# EAGLE schematic cwm_ (EAGLE 7.5.0)
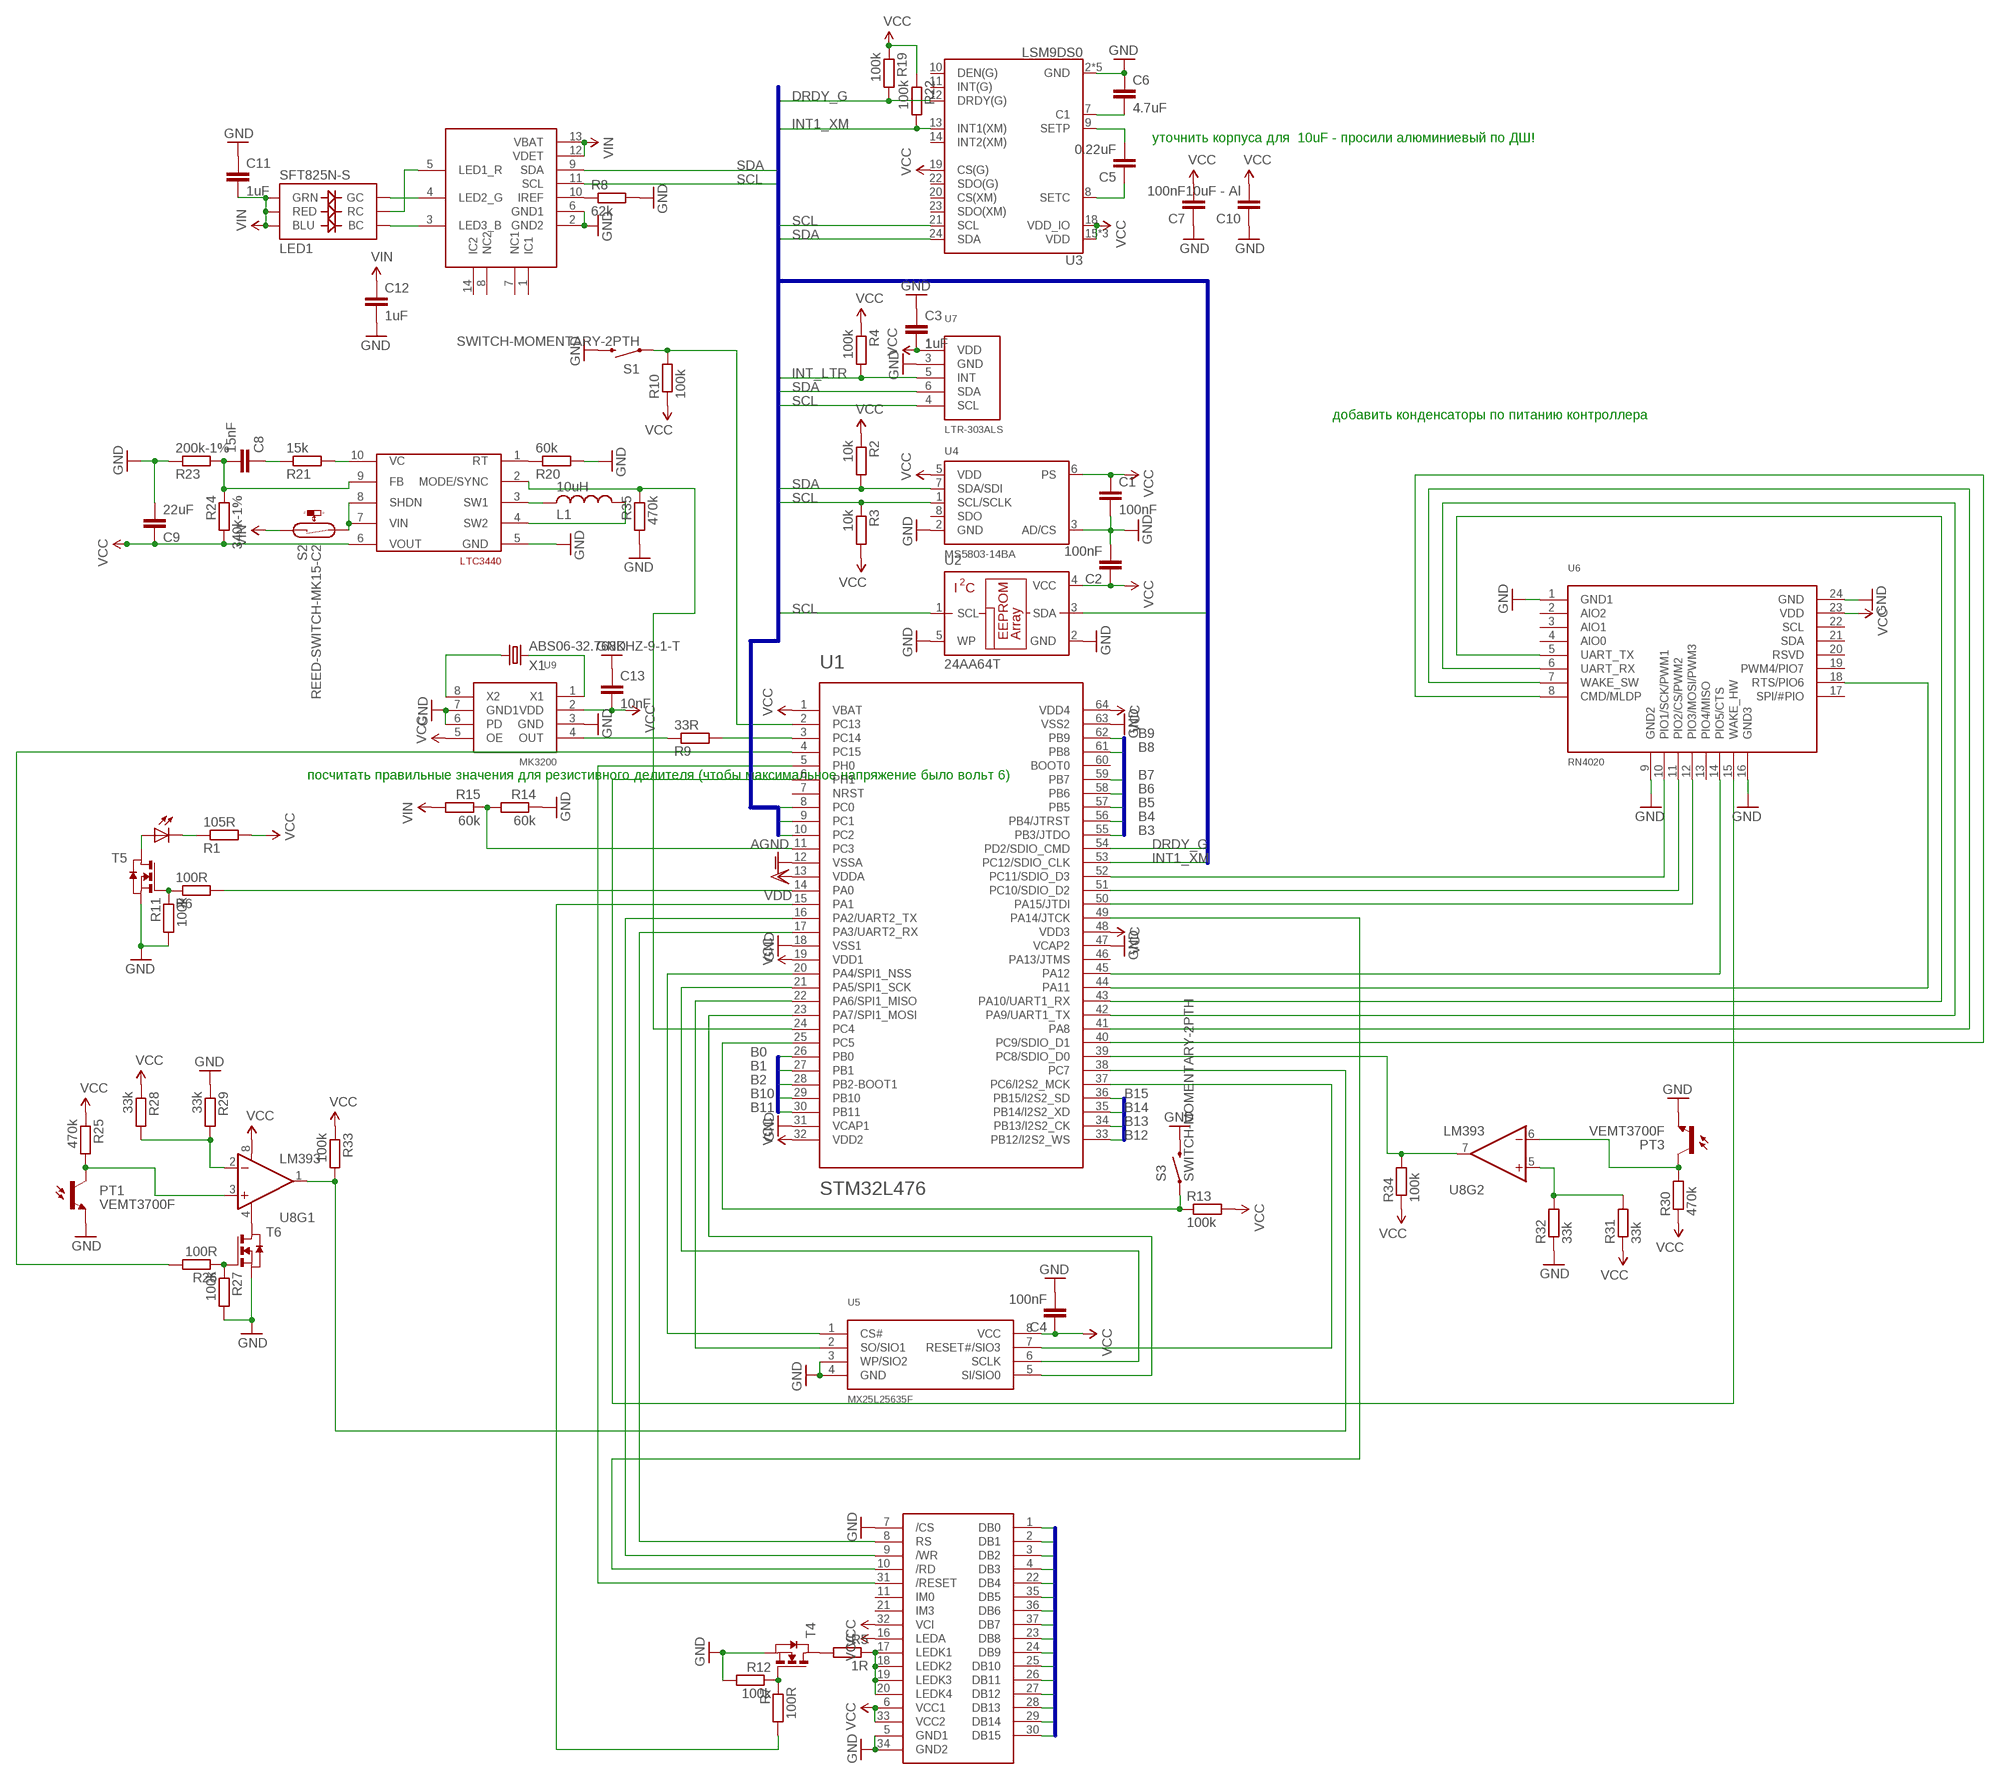
[diagram p0: schematic, sheet 1]

## Parts
C1  100nF  C-EUC0402  [C0402]
C2  100nF  C-EUC0402  [C0402]
C3  1uF  C-EUC0603  [C0603]
C4  100nF  C-EUC0402  [C0402]
C5  0.22uF  C-EUC0402  [C0402]
C6  4.7uF  C-EUC0805  [C0805]
C7  100nF  C-EUC0402  [C0402]
C8  15nF  C-EUC0402  [C0402]
C9  22uF  C-EUC0805  [C0805]
C10  10uF - Al  C-EUC0805  [C0805]
C11  1uF  C-EUC0603  [C0603]
C12  1uF  C-EUC0603  [C0603]
C13  10nF  C-EUC0603  [C0603]
L1  10uH  L-USL3225M  [L3225M]
LED1  SFT825N-S  LED-TRICOLOR-NO-COMPLCC-6-SMD  [PLCC-6-LED]
PT1  VEMT3700F  [PLCC-2]
PT3  VEMT3700F  [PLCC-2]
R1  105R  R-EU_R0402  [R0402]
R2  10k  R-EU_R0402  [R0402]
R3  10k  R-EU_R0402  [R0402]
R4  100k  R-EU_R0402  [R0402]
R5  1R  R-EU_R0402  [R0402]
R6  100R  R-EU_R0402  [R0402]
R7  100R  R-EU_R0402  [R0402]
R8  62k  R-EU_R0402  [R0402]
R9  33R  R-EU_R0402  [R0402]
R10  100k  R-EU_R0402  [R0402]
R11  100k  R-EU_R0402  [R0402]
R12  100k  R-EU_R0402  [R0402]
R13  100k  R-EU_R0402  [R0402]
R14  60k  R-EU_R0402  [R0402]
R15  60k  R-EU_R0402  [R0402]
R19  100k  R-EU_R0402  [R0402]
R20  60k  R-EU_R0402  [R0402]
R21  15k  R-EU_R0402  [R0402]
R22  100k  R-EU_R0402  [R0402]
R23  200k-1%  R-EU_R0402  [R0402]
R24  340k-1%  R-EU_R0402  [R0402]
R25  470k  R-EU_R0402  [R0402]
R26  100R  R-EU_R0402  [R0402]
R27  100k  R-EU_R0402  [R0402]
R28  33k  R-EU_R0402  [R0402]
R29  33k  R-EU_R0402  [R0402]
R30  470k  R-EU_R0402  [R0402]
R31  33k  R-EU_R0402  [R0402]
R32  33k  R-EU_R0402  [R0402]
R33  100k  R-EU_R0402  [R0402]
R34  100k  R-EU_R0402  [R0402]
R35  470k  R-EU_R0402  [R0402]
S1  SWITCH-MOMENTARY-2PTH  [TACTILE-PTH]
S2  REED-SWITCH-MK15-C2  [MK15]
S3  SWITCH-MOMENTARY-2PTH  [TACTILE-PTH]
T4  NMOSSOT23  [SOT-23]
T5  NMOSSOT23  [SOT-23]
T6  NMOSSOT23  [SOT-23]
U1  STM32L476  STM32F405RG  [TQFP64]
U2  24AA64T  24AA00OT  [SOT23-5L]
U3  LSM9DS0  [LGA-24]
U4  MS5803-14BA  [MS5803]
U5  MX25L25635F  [WSON8L]
U6  RN4020  [RN4020]
U7  LTR-303ALS  [LTR-303ALS]
U8  LM393  [SO08]
U9  MK3200  [SOIC8]
U$1  S95466-AAA  [S95466-AAA]
U$2  VSML3710  [PLCC-2]
U$3  NCP5623  [NCP5623]
U$9  LTC3440  [MSOP10]
X1  ABS06-32.768KHZ-9-1-T  CRYSTALS-NOGND-IQXC-25  [2.0X1.2-2PAD]

## Nets
AGND: U1.12(VSSA)
B0: U1.26(PB0) U$1.1(DB0)
B1: U1.27(PB1) U$1.2(DB1)
B2: U1.28(PB2-BOOT1) U$1.3(DB2)
B3: U1.55(PB3/JTDO) U$1.4(DB3)
B4: U1.56(PB4/JTRST) U$1.22(DB4)
B5: U1.57(PB5) U$1.35(DB5)
B6: U1.58(PB6) U$1.36(DB6)
B7: U1.59(PB7) U$1.37(DB7)
B8: U1.61(PB8) U$1.23(DB8)
B9: U1.62(PB9) U$1.24(DB9)
B10: U1.29(PB10) U$1.25(DB10)
B11: U1.30(PB11) U$1.26(DB11)
B12: U1.33(PB12/I2S2_WS) U$1.27(DB12)
B13: U1.34(PB13/I2S2_CK) U$1.28(DB13)
B14: U1.35(PB14/I2S2_XD) U$1.29(DB14)
B15: U1.36(PB15/I2S2_SD) U$1.30(DB15)
DRDY_G: R19.2 U1.54(PD2/SDIO_CMD) U3.12(DRDY(G))
GND [GND]: C1.2 C2.2 C3.1 C4.2 C6.1 C7.1 C9.2 C10.1 C11.1 C12.2 C13.1 PT1.P$2(E) PT3.P$2(E) R8.2 R11.2 R12.2 R14.1 R20.2 R23.1 R27.2 R29.1 R32.1 R35.2 S1.3 S3.3 T4.2(S) T5.2(S) T6.2(S) U1.18(VSS1) U1.31(VCAP1) U1.47(VCAP2) U1.63(VSS2) U2.2(GND) U2.5(WP) U3.2(GND) U3.3(GND) U3.4(GND) U3.5(GND) U3.6(GND) U4.2(GND) U4.3(AD/CS) U5.3(WP/SIO2) U5.4(GND) U6.1(GND1) U6.9(GND2) U6.16(GND3) U6.24(GND) U7.3(GND) U9.3(GND) U9.6(PD) U9.7(GND1) U$1.5(GND1) U$1.7(/CS) U$1.34(GND2) U$3.2(GND2) U$3.6(GND1) U$9.5(GND)
INT1_XM: R22.2 U1.53(PC12/SDIO_CLK) U3.13(INT1(XM))
INT_LTR: R4.2 U1.10(PC2) U7.5(INT)
N$1 [VIN]: S2.2 U$9.7(VIN) U$9.8(SHDN)
N$2: R5.1 U$1.17(LEDK1) U$1.18(LEDK2) U$1.19(LEDK3) U$1.20(LEDK4)
N$3: T5.1(D) U$2.P$2(A)
N$4: C5.2 U3.9(SETP)
N$5: U1.6(PH1) U6.15(WAKE_HW)
N$6: U1.17(PA3/UART2_RX) U$1.8(RS)
N$7: U1.5(PH0) U$1.31(/RESET)
N$8: U1.16(PA2/UART2_TX) U$1.9(/WR)
N$9: R35.1 U1.24(PC4) U$9.2(MODE/SYNC)
N$10: R5.2 T4.1(D)
N$11: LED1.CG(GC) U$3.4(LED2_G)
N$12: LED1.CB(BC) U$3.3(LED3_B)
N$13: LED1.CR(RC) U$3.5(LED1_R)
N$14: R1.1 U$2.P$1(C)
N$15: R6.1 R11.1 T5.3(G)
N$16: R6.2 U1.14(PA0)
N$17: R7.1 R12.1 T4.3(G)
N$18: R7.2 U1.15(PA1)
N$19: U9.1(X1) X1.2
N$20: R8.1 U$3.10(IREF)
N$21: U9.8(X2) X1.1
N$22: R9.1 U9.4(OUT)
N$23: U1.49(PA14/JTCK) U$1.10(/RD)
N$24: R10.2 S1.1 U1.2(PC13)
N$25: R13.1 S3.1 U1.25(PC5)
N$26: R9.2 U1.3(PC14)
N$27: U1.42(PA9/UART1_TX) U6.6(UART_RX)
N$28: L1.2 U$9.3(SW1)
N$29: L1.1 U$9.4(SW2)
N$30: C5.1 U3.8(SETC)
N$31: C6.2 U3.7(C1)
N$32: T6.1(D) U8.4(V-)
N$33: PT1.P$1(C) R25.2 U8.3(+IN)
N$34: R28.2 R29.2 U8.2(-IN)
N$37: PT3.P$1(C) R30.2 U8.6(-IN)
N$38: R26.1 R27.1 T6.3(G)
N$39: R26.2 U1.4(PC15)
N$40: R31.2 R32.2 U8.5(+IN)
N$41: R33.2 U1.38(PC7) U8.1(OUT)
N$42: R34.2 U1.39(PC8/SDIO_D0) U8.7(OUT)
N$43: U1.43(PA10/UART1_RX) U6.5(UART_TX)
N$44: U1.44(PA11) U6.18(RTS/PIO6)
N$45: U1.45(PA12) U6.14(PIO5/CTS)
N$46: U1.40(PC9/SDIO_D1) U6.8(CMD/MLDP)
N$47: U1.41(PA8) U6.7(WAKE_SW)
N$49: U1.52(PC11/SDIO_D3) U6.10(PIO1/SCK/PWM1)
N$50: U1.51(PC10/SDIO_D2) U6.11(PIO2/CS/PWM2)
N$51: U1.50(PA15/JTDI) U6.12(PIO3/MOSI/PWM3)
N$52: R20.1 U$9.1(RT)
N$53: U1.20(PA4/SPI1_NSS) U5.1(CS#)
N$54: U1.22(PA6/SPI1_MISO) U5.2(SO/SIO1)
N$55: U1.37(PC6/I2S2_MCK) U5.7(RESET#/SIO3)
N$56: U1.21(PA5/SPI1_SCK) U5.6(SCLK)
N$57: U1.23(PA7/SPI1_MOSI) U5.5(SI/SIO0)
N$60: R14.2 R15.1 U1.11(PC3)
N$70: C8.2 R23.2 R24.1 U$9.9(FB)
N$73: R21.2 U$9.10(VC)
N$74: C8.1 R21.1
SCL: R3.1 U1.8(PC0) U2.1(SCL) U3.21(SCL) U4.1(SCL/SCLK) U7.4(SCL) U$3.11(SCL)
SDA: R2.2 U1.9(PC1) U2.3(SDA) U3.24(SDA) U4.7(SDA/SDI) U7.6(SDA) U$3.9(SDA)
VCC [VCC]: C1.1 C2.1 C3.2 C4.1 C7.2 C9.1 C10.2 C13.2 R1.2 R2.1 R3.2 R4.1 R10.1 R13.2 R19.1 R22.1 R24.2 R25.1 R28.1 R30.1 R31.1 R33.1 R34.1 U1.1(VBAT) U1.19(VDD1) U1.32(VDD2) U1.48(VDD3) U1.64(VDD4) U2.4(VCC) U3.15(VDD) U3.16(VDD) U3.17(VDD) U3.18(VDD_IO) U3.19(CS(G)) U4.5(VDD) U4.6(PS) U5.8(VCC) U6.23(VDD) U7.1(VDD) U8.8(V+) U9.2(VDD) U9.5(OE) U$1.6(VCC1) U$1.16(LEDA) U$1.32(VCI) U$1.33(VCC2) U$9.6(VOUT)
VDD: U1.13(VDDA)
VIN [VIN]: C11.2 C12.1 LED1.AB(BLU) LED1.AG(GRN) LED1.AR(RED) R15.2 S2.1 U$3.12(VDET) U$3.13(VBAT)
Unconnected: U1.7(NRST) U1.46(PA13/JTMS) U1.60(BOOT0) U3.10(DEN(G)) U3.11(INT(G)) U3.14(INT2(XM)) U3.20(CS(XM)) U3.22(SDO(G)) U3.23(SDO(XM)) U4.8(SDO) U6.2(AIO2) U6.3(AIO1) U6.4(AIO0) U6.13(PIO4/MISO) U6.17(SPI/#PIO) U6.19(PWM4/PIO7) U6.20(RSVD) U6.21(SDA) U6.22(SCL) U$1.11(IM0) U$1.21(IM3) U$3.1(IC1) U$3.7(NC1) U$3.8(NC2) U$3.14(IC2)

## Buses
B[0..15]
SDA,SCL,DRDY_G,INT1_XM,INT_LTR

## Notes on the sheet
- уточнить корпуса для  10uF - просили алюминиевый по ДШ!
- добавить конденсаторы по питанию контроллера
- посчитать правильные значения для резистивного делителя (чтобы максимальное напряжение было вольт 6)

## Library data of the parts
C1-C13 = resistor:C-EU: CAPACITOR, European symbol
L1 = resistor:L-US: INDUCTOR, American symbol
LED1 = SparkFun-LED:LED-TRICOLOR-NO-COM; PROD_ID: DIO-12113
PT1 PT3 = vishay_opto:VEMT3700F
R1-R15 R19-R35 = resistor:R-EU_: RESISTOR, European symbol
S1 S3 = SparkFun-Electromechanical:SWITCH-MOMENTARY-2: Various NO switches- pushbuttons, reed, etc; PROD_ID: SWCH-08441
S2 = switch-reed:REED-SWITCH-: Reed Sensor; MF: MEDER; MPN: MK15-C-2; OC_FARNELL: 1079485
T4-T6 = zetex:NMOSSOT23: MOS FET; OC_FARNELL: unknown; OC_NEWARK: unknown
U1 = SparkFun-DigitalIC:STM32F405RG: ARM DSP Chip used on the WAV Trigger board.
U2 = microchip:24*00: Serial EEPROM 128 bit, I2C (AA = 1.8 V/LC = 2.5 V/C = 5.0 V); MF: MICROCHIP; MPN: 24AA00T-I/OTG; OC_FARNELL: 1331264; OC_NEWARK: 89H3038
U3 = SparkFun-DigitalIC:LSM9DS0: LSM9DS0 3D Accelerometer, 3D Gyroscope, 3D Magnetomter Features: 3 acceleration channels, 3 angular rate channels, 3 magnetic field channels ±2/±4/±6/±8/±16 g linear acceleration full scale ±2/±4/±8/±12 gauss magnetic full scale ±245/±500/±2000 dps angular rate full scale 16-bit data output SPI / I2C serial interfaces Analog supply voltage 2.4 V to 3.6 V Power-down mode / low-power mode Programmable interrupt generators Embedded self-test Embedded temperature sensor Embedded FIFO Position and motion detection functions Click/double-click recognition
U4 = MS5803:MS5803-14BA; PROD_ID: IC-12111
U5 = MX25L25635F:MX25L25635F
U6 = RN4020:RN4020
U7 = LTR_303ALS:LTR-303ALS
U8 = SparkFun-AnalogIC:LM393: Low-voltage comparator
U9 = MK3200:MK3200
U$1 = screen_37pin:S95466-AAA
U$2 = vishay_opto:VSML3710
U$3 = NCP5623:NCP5623
U$9 = SparkFun:LTC3440
X1 = IQD-Frequency-Products:CRYSTALS-NOGND: CRYSTALS CAN NOT GROUNDED

## Net classes
1 VIN: width 0.254 mm, drill 0.4 mm, clearance 0.2 mm
2 GND: width 0.254 mm, drill 0.4 mm, clearance 0.2 mm
3 VCC: width 0.254 mm, drill 0.4 mm, clearance 0.2 mm